# EAGLE design e-Tapperhandpiece18 (EAGLE 8.4.1)
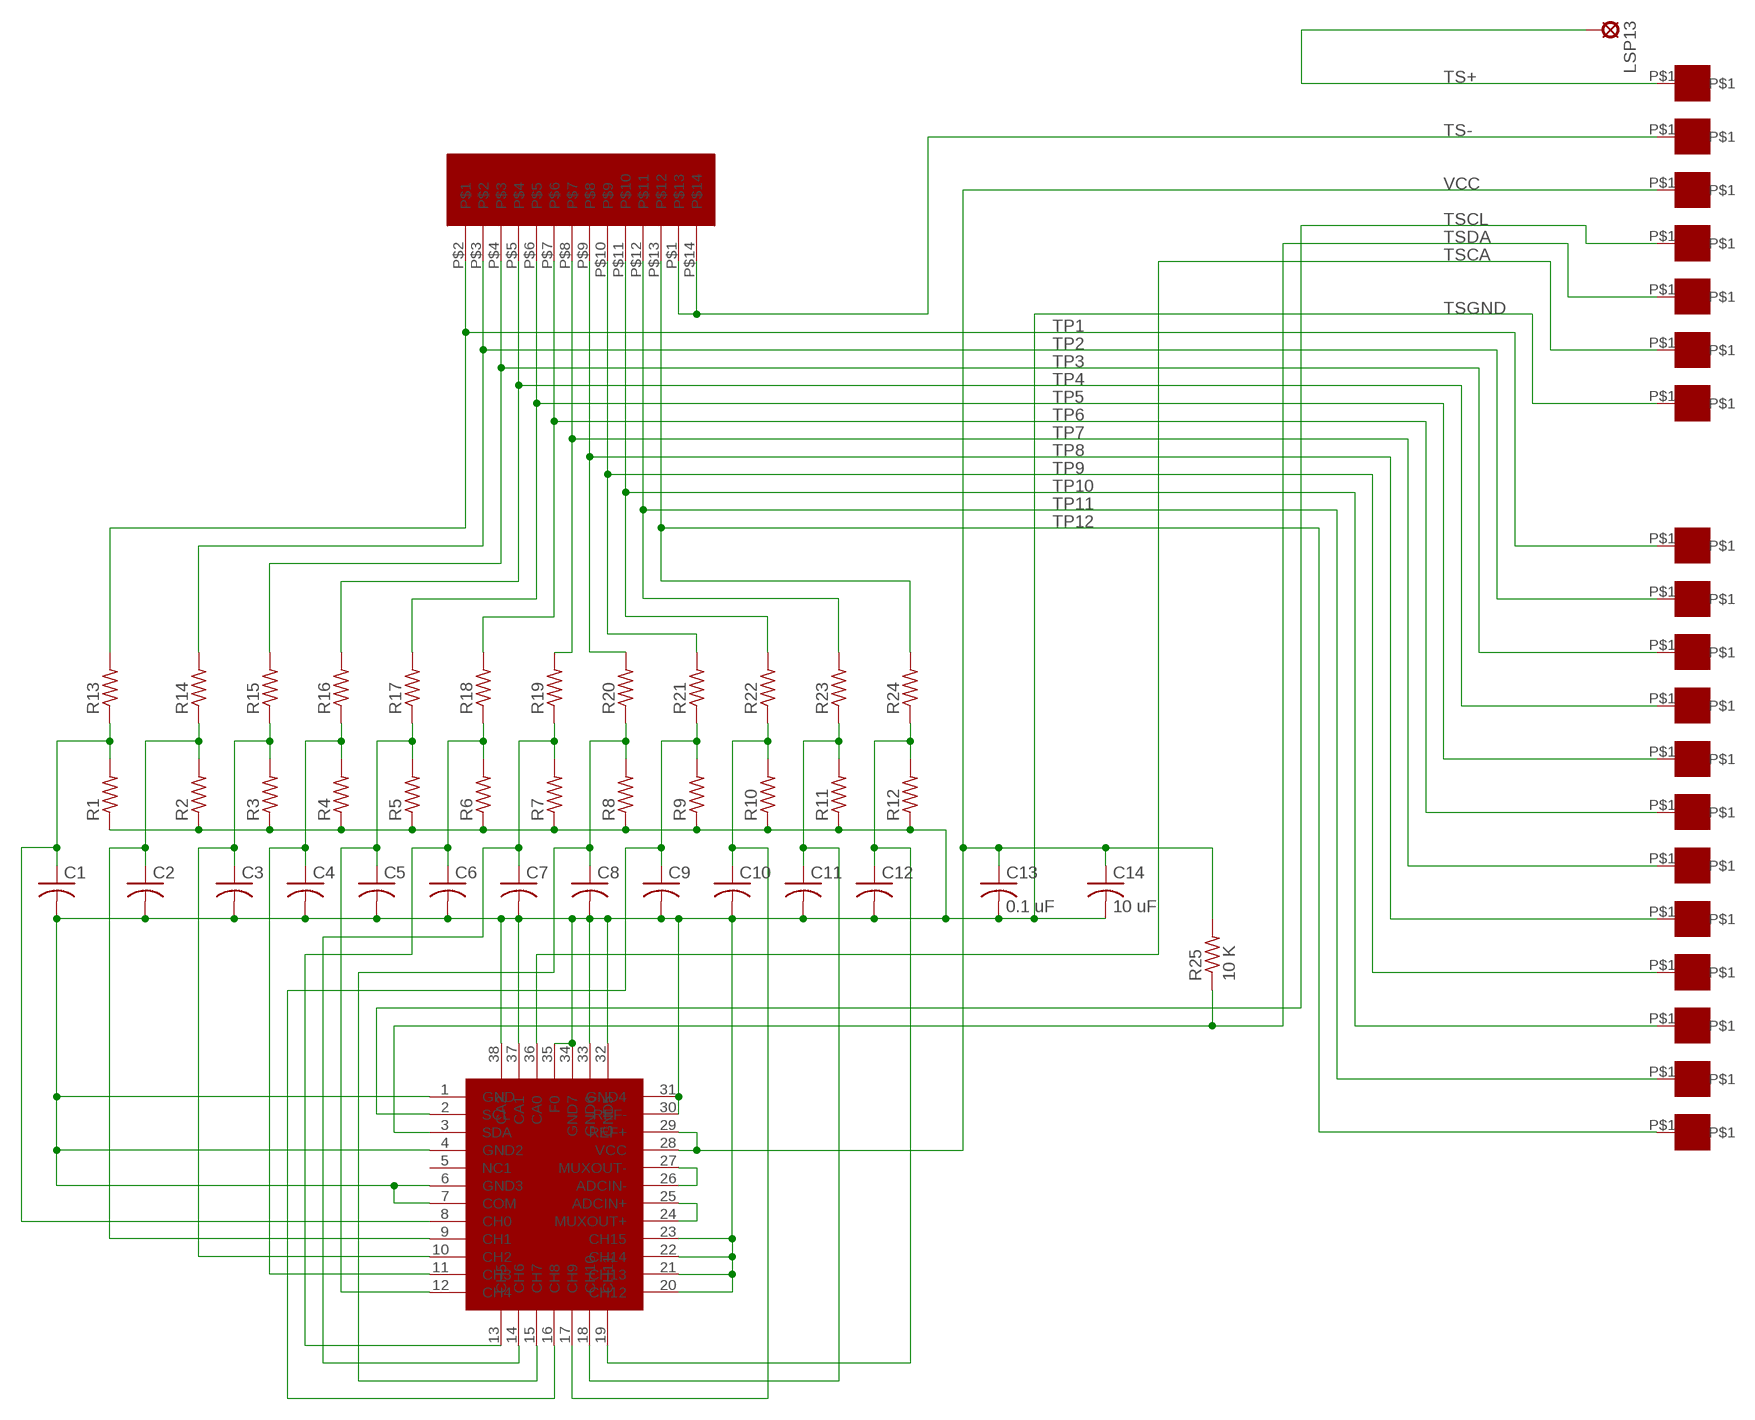
[diagram p0: schematic, sheet 1]

## Parts
C1  C-USC0603  [C0603]
C2  C-USC0603  [C0603]
C3  C-USC0603  [C0603]
C4  C-USC0603  [C0603]
C5  C-USC0603  [C0603]
C6  C-USC0603  [C0603]
C7  C-USC0603  [C0603]
C8  C-USC0603  [C0603]
C9  C-USC0603  [C0603]
C10  C-USC0603  [C0603]
C11  C-USC0603  [C0603]
C12  C-USC0603  [C0603]
C13  0.1 uF  C-USC0603  [C0603]
C14  10 uF  C-USC0805  [C0805]
LSP13  SE11  [SE11]
R1  R-US_R0402  [R0402]
R2  R-US_R0402  [R0402]
R3  R-US_R0402  [R0402]
R4  R-US_R0402  [R0402]
R5  R-US_R0402  [R0402]
R6  R-US_R0402  [R0402]
R7  R-US_R0402  [R0402]
R8  R-US_R0402  [R0402]
R9  R-US_R0402  [R0402]
R10  R-US_R0402  [R0402]
R11  R-US_R0402  [R0402]
R12  R-US_R0402  [R0402]
R13  R-US_R0402  [R0402]
R14  R-US_R0402  [R0402]
R15  R-US_R0402  [R0402]
R16  R-US_R0402  [R0402]
R17  R-US_R0402  [R0402]
R18  R-US_R0402  [R0402]
R19  R-US_R0402  [R0402]
R20  R-US_R0402  [R0402]
R21  R-US_R0402  [R0402]
R22  R-US_R0402  [R0402]
R23  R-US_R0402  [R0402]
R24  R-US_R0402  [R0402]
R25  10 K  R-US_R0402  [R0402]
TSP1  ET1  [ET1]
TSP2  ET1  [ET1]
TSP3  ET1  [ET1]
TSP4  ET1  [ET1]
TSP5  ET1  [ET1]
TSP6  ET1  [ET1]
TSP7  ET1  [ET1]
TSP8  ET1  [ET1]
TSP9  ET1  [ET1]
TSP10  ET1  [ET1]
TSP11  ET1  [ET1]
TSP12  ET1  [ET1]
TSP13  ET1  [ET1]
TSP14  ET1  [ET1]
TSP15  ET1  [ET1]
TSP16  ET1  [ET1]
TSP17  ET1  [ET1]
TSP18  ET1  [ET1]
TSP19  ET1  [ET1]
U$1  LTC2497  [QFN38-5X7]
U$2  SS112D01  [SS112D01]

## Nets
N$1: C9.1 R9.2 R21.1 U$1.16(CH8)
N$2: U$1.26(ADCIN-) U$1.27(MUXOUT-)
N$3: U$1.24(MUXOUT+) U$1.25(ADCIN+)
N$5: C12.1 R12.2 R24.1 U$1.19(CH11)
N$7: C4.1 R4.2 R16.1 U$1.11(CH3)
N$8: C10.1 R10.2 R22.1 U$1.17(CH9)
N$9: C8.1 R8.2 R20.1 U$1.15(CH7)
N$18: C5.1 R5.2 R17.1 U$1.12(CH4)
N$19: C6.1 R6.2 R18.1 U$1.13(CH5)
N$20: C7.1 R7.2 R19.1 U$1.14(CH6)
N$22: C3.1 R3.2 R15.1 U$1.10(CH2)
N$23: C2.1 R2.2 R14.1 U$1.9(CH1)
N$24: C11.1 R11.2 R23.1 U$1.18(CH10)
N$25: C1.1 R1.2 R13.1 U$1.8(CH0)
TP1: R13.2 TSP1.P$1 U$2.P$2
TP2: R14.2 TSP2.P$1 U$2.P$3
TP3: R15.2 TSP3.P$1 U$2.P$4
TP4: R16.2 TSP4.P$1 U$2.P$5
TP5: R17.2 TSP5.P$1 U$2.P$6
TP6: R18.2 TSP6.P$1 U$2.P$7
TP7: R19.2 TSP7.P$1 U$2.P$8
TP8: R20.2 TSP8.P$1 U$2.P$9
TP9: R21.2 TSP9.P$1 U$2.P$10
TP10: R22.2 TSP10.P$1 U$2.P$11
TP11: R23.2 TSP11.P$1 U$2.P$12
TP12: R24.2 TSP12.P$1 U$2.P$13
TS+: LSP13.MP TSP13.P$1
TS-: TSP14.P$1 U$2.P$1 U$2.P$14
TSCA: TSP18.P$1 U$1.36(CA0)
TSCL: TSP16.P$1 U$1.2(SCL)
TSDA: R25.1 TSP17.P$1 U$1.3(SDA)
TSGND: C1.2 C2.2 C3.2 C4.2 C5.2 C6.2 C7.2 C8.2 C9.2 C10.2 C11.2 C12.2 C13.2 C14.2 R1.1 R2.1 R3.1 R4.1 R5.1 R6.1 R7.1 R8.1 R9.1 R10.1 R11.1 R12.1 TSP19.P$1 U$1.1(GND) U$1.4(GND2) U$1.6(GND3) U$1.7(COM) U$1.20(CH12) U$1.21(CH13) U$1.22(CH14) U$1.23(CH15) U$1.30(REF-) U$1.31(GND4) U$1.32(GND5) U$1.33(GND6) U$1.34(GND7) U$1.35(F0) U$1.37(CA1) U$1.38(CA2)
VCC: C13.1 C14.1 R25.2 TSP15.P$1 U$1.28(VCC) U$1.29(REF+)
Unconnected: U$1.5(NC1)

## Library data of the parts
C1-C14 = rcl:C-US: CAPACITOR, American symbol
LSP13 = solpad:SE11: SOLDER PAD RTM, drill 1,1mm, distributor Buerklin, 07F810
R1-R25 = resistor:R-US_: RESISTOR, American symbol
TSP1-TSP19 = ET1:ET1: Through Hold Pads 20 mil drill hole
U$1 = LTC2497:LTC2497: LTC2497 16 Channel ADC with I2C interface
U$2 = SS112D01:SS112D01

## Net classes
0 default: clearance 0.205 mm

## Board
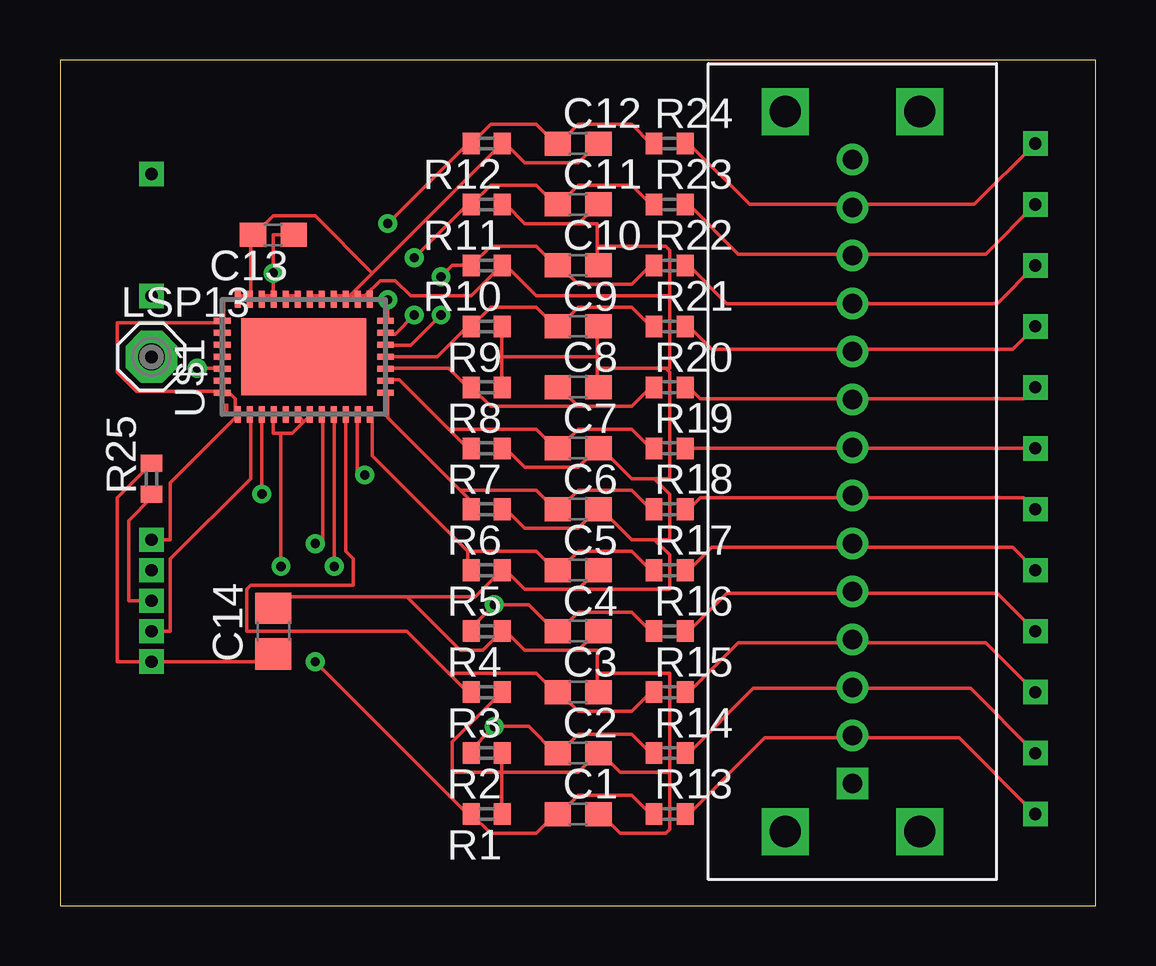
[diagram p1: board, top side]
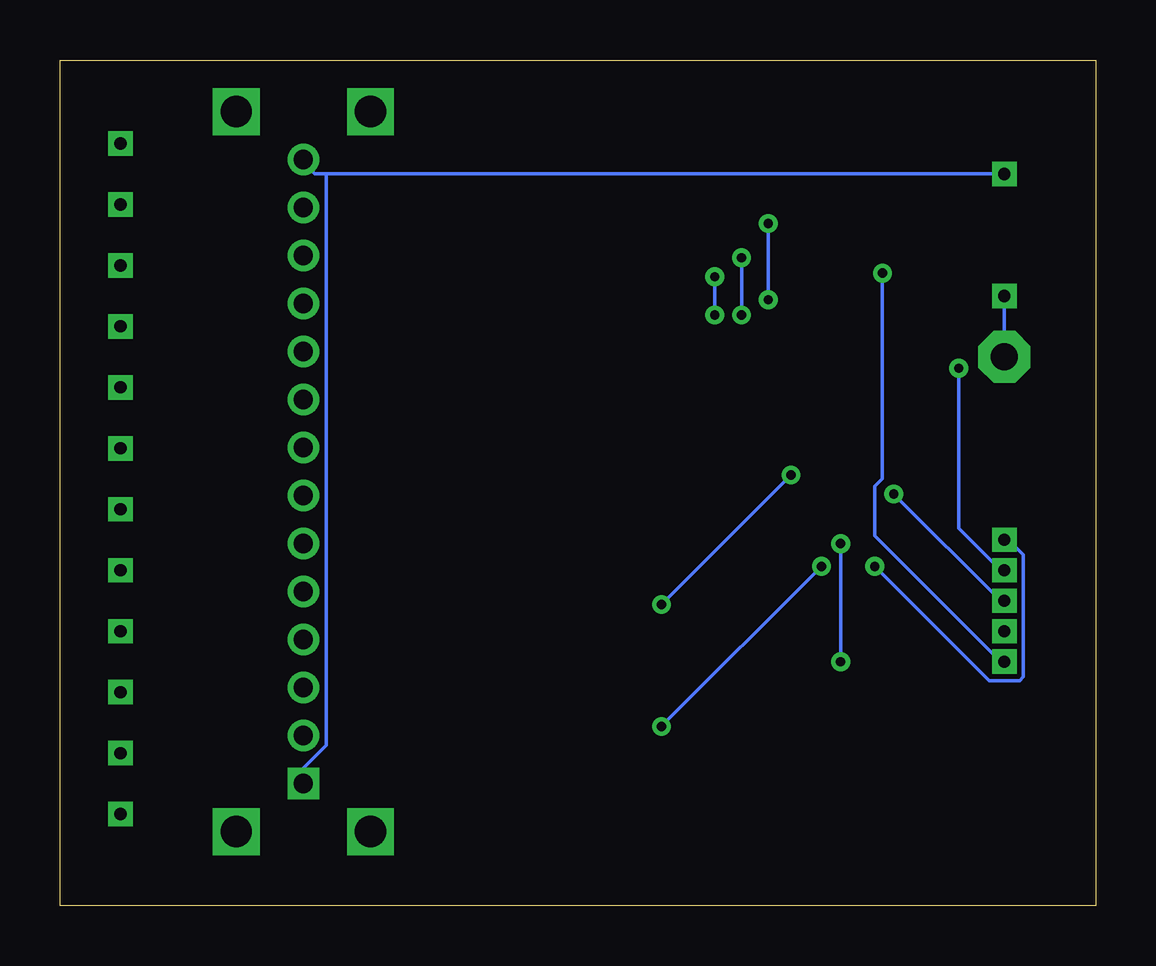
[diagram p2: board, bottom side, seen from below]

Size 43.16 x 35.23 mm. Coordinates in mm from the lower left corner, seen from the top.
Outline: 0,0 43.16,0 43.16,35.23 0,35.23 0,0
Copper layers (1*16): Top 0.035mm / dielectric 1.5mm / Bottom 0.035mm
Design rules "e-tapperhandpiece14 *": minimum track width 6mil, minimum drill 15mil, track to track 6mil, track to pad 6mil, pad to pad 6mil, via to via 6mil, smd to smd 5mil, copper to edge 6mil, drill to drill 6mil, minimum pad ring 10mil, minimum via ring 8mil, stop-mask expansion 4mil, vias tented up to drill 0mil, thermal gap 10mil

### Footprints (pad centres in the part's own frame; a part is rotated, then mirrored left to right if it is on the bottom)
C0603 = smd 1.1 x 1: 1 -0.85,0; 2 0.85,0
C0805 = smd 1.3 x 1.5: 1 -0.95,0; 2 0.95,0
SE11 = drill 1.118 pad 2.159 octagon: MP 0,0
R0402 = smd 0.7 x 0.9: 1 -0.65,0; 2 0.65,0
ET1 = drill 0.508 square: P$1 0,0
QFN38-5X7 = smd 0.7 x 0.25: 1 -2.4,2.75; 2 -2.4,2.25; 3 -2.4,1.75; 4 -2.4,1.25; 5 -2.4,0.75; 6 -2.4,0.25; 7 -2.4,-0.25; 8 -2.4,-0.75; 9 -2.4,-1.25; 10 -2.4,-1.75; 11 -2.4,-2.25; 12 -2.4,-2.75; 20 2.4,-2.75; 21 2.4,-2.25; 22 2.4,-1.75; 23 2.4,-1.25; 24 2.4,-0.75; 25 2.4,-0.25; 26 2.4,0.25; 27 2.4,0.75; 28 2.4,1.25; 29 2.4,1.75; 30 2.4,2.25; 31 2.4,2.75 | smd 0.25 x 0.7: 13 -1.5,-3.4; 14 -1,-3.4; 15 -0.5,-3.4; 16 0,-3.4; 17 0.5,-3.4; 18 1,-3.4; 19 1.5,-3.4; 32 1.5,3.4; 33 1,3.4; 34 0.5,3.4; 35 0,3.4; 36 -0.5,3.4; 37 -1,3.4; 38 -1.5,3.4 | smd 3.2 x 5.2: EXP 0,0
SS112D01 = drill 0.8 square: P$1 6.35,3.81 | drill 0.8: P$2 6.35,5.81; P$3 6.35,7.81; P$4 6.35,9.81; P$5 6.35,11.81; P$6 6.35,13.81; P$7 6.35,15.81; P$8 6.35,17.81; P$9 6.35,19.81; P$10 6.35,21.81; P$11 6.35,23.81; P$12 6.35,25.81; P$13 6.35,27.81; P$14 6.35,29.81 | drill 1.3 square: P$15 9.15,31.81; P$16 3.55,31.81; P$17 9.15,1.81; P$18 3.55,1.81

### Placement (x,y rotation side)
C1  21.59,3.81 0 top
C2  21.59,6.35 0 top
C3  21.59,8.89 0 top
C4  21.59,11.43 0 top
C5  21.59,13.97 0 top
C6  21.59,16.51 0 top
C7  21.59,19.05 0 top
C8  21.59,21.59 0 top
C9  21.59,24.13 0 top
C10  21.59,26.67 0 top
C11  21.59,29.21 0 top
C12  21.59,31.75 0 top
C13  8.89,27.94 180 top
C14  8.89,11.43 90 top
LSP13  3.81,22.86 0 top
R1  17.78,3.81 180 top
R2  17.78,6.35 180 top
R3  17.78,8.89 180 top
R4  17.78,11.43 180 top
R5  17.78,13.97 180 top
R6  17.78,16.51 180 top
R7  17.78,19.05 180 top
R8  17.78,21.59 180 top
R9  17.78,24.13 180 top
R10  17.78,26.67 180 top
R11  17.78,29.21 180 top
R12  17.78,31.75 180 top
R13  25.4,3.81 0 top
R14  25.4,6.35 0 top
R15  25.4,8.89 0 top
R16  25.4,11.43 0 top
R17  25.4,13.97 0 top
R18  25.4,16.51 0 top
R19  25.4,19.05 0 top
R20  25.4,21.59 0 top
R21  25.4,24.13 0 top
R22  25.4,26.67 0 top
R23  25.4,29.21 0 top
R24  25.4,31.75 0 top
R25  3.81,17.78 90 top
TSP1  40.64,3.81 0 top
TSP2  40.64,6.35 0 top
TSP3  40.64,8.89 0 top
TSP4  40.64,11.43 0 top
TSP5  40.64,13.97 0 top
TSP6  40.64,16.51 0 top
TSP7  40.64,19.05 0 top
TSP8  40.64,21.59 0 top
TSP9  40.64,24.13 0 top
TSP10  40.64,26.67 0 top
TSP11  40.64,29.21 0 top
TSP12  40.64,31.75 0 top
TSP13  3.81,25.4 0 top
TSP14  3.81,30.48 0 top
TSP15  3.81,10.16 0 top
TSP16  3.81,11.43 0 top
TSP17  3.81,12.7 0 top
TSP18  3.81,13.97 90 top
TSP19  3.81,15.24 90 top
U$1  10.16,22.86 90 top
U$2  26.67,1.27 0 top

### Tracks (layer width: path | path; a pad name or v marks a point on that pad's centre or on a via)
N$1
  Top 0.152: R21.1 24.61,24.13 23.81,24.92 21.59,24.92 20.8,24.13 C9.1 20.64,24.13 19.84,24.92 17.94,24.92 17.14,24.13 R9.2 16.99,24.13 15.72,22.86 U$1.16
N$2
  Top 0.152: U$1.27 9.53,25.4 9.84,25.4 U$1.26
N$3
  Top 0.152: U$1.25 10.48,25.4 10.79,25.4 U$1.24
N$5  (via drill 0.38)
  Top 0.152: R24.1 24.61,31.75 23.81,32.54 21.59,32.54 20.8,31.75 C12.1 20.64,31.75 19.84,32.54 17.94,32.54 17.14,31.75 R12.2 16.99,31.75 v13.65,28.42 | v13.65,25.24 13.65,24.45 U$1.19
  Bottom 0.152: v13.65,28.42 v13.65,25.24
N$7  (via drill 0.38)
  Top 0.152: R16.1 24.61,11.43 23.81,12.22 21.59,12.22 20.8,11.43 C4.1 20.64,11.43 19.53,12.54 v18.1,12.54 16.99,11.43 R4.2 | v12.7,17.94 12.38,17.94 12.38,20.32 U$1.11
  Bottom 0.152: v18.1,12.54 v12.7,17.94
N$8  (via drill 0.38)
  Top 0.152: R22.1 24.61,26.67 23.81,25.88 21.59,25.88 20.8,26.67 C10.1 20.64,26.67 19.84,27.46 17.94,27.46 17.14,26.67 R10.2 16.35,26.67 v15.88,26.19 | v15.88,24.61 14.61,23.34 13.65,23.34 U$1.17
  Bottom 0.152: v15.88,26.19 v15.88,24.61
N$9
  Top 0.152: U$1.15 13.65,22.38 16.19,22.38 16.99,21.59 R8.2 17.14,21.59 17.94,20.8 21.59,20.8 | 21.59,20.8 23.81,20.8 24.61,21.59 R20.1 | 21.59,20.8 20.8,21.59 C8.1
N$18
  Top 0.152: R17.1 24.61,13.97 23.81,14.76 21.59,14.76 20.8,13.97 C5.1 20.64,13.97 19.84,14.76 16.99,14.76 | 16.99,14.76 13.02,18.73 13.02,20.32 U$1.12 | 16.99,14.76 16.99,13.97 R5.2
N$19
  Top 0.152: R18.1 24.61,16.51 23.81,17.3 21.59,17.3 20.8,16.51 C6.1 20.64,16.51 19.84,17.3 16.67,17.3 | 16.67,17.3 16.99,16.99 16.99,16.51 R6.2 | 16.67,17.3 13.65,20.32 13.65,21.27 U$1.13
N$20
  Top 0.152: R19.1 24.61,19.05 23.81,19.84 21.59,19.84 20.8,19.05 C7.1 20.64,19.05 19.84,19.84 16.19,19.84 | 16.19,19.84 16.99,19.05 R7.2 | 16.19,19.84 14.13,21.91 13.65,21.91 U$1.14
N$22
  Top 0.152: R15.1 24.61,8.89 23.81,8.1 21.59,8.1 20.8,8.89 C3.1 20.64,8.89 19.84,9.68 16.19,9.68 | 16.19,9.68 16.99,8.89 R3.2 | 16.19,9.68 14.45,11.43 7.78,11.43 7.78,13.18 7.94,13.34 12.22,13.34 12.22,14.45 11.91,14.76 11.91,20.32 U$1.10
N$23  (via drill 0.38)
  Top 0.152: R14.1 24.61,6.35 23.81,7.14 21.59,7.14 20.8,6.35 C2.1 20.64,6.35 19.53,7.46 v18.1,7.46 16.99,6.35 R2.2 | v11.43,14.13 11.43,20.32 U$1.9
  Bottom 0.152: v18.1,7.46 v11.43,14.13
N$24  (via drill 0.38)
  Top 0.152: R23.1 24.61,29.21 23.81,30 21.59,30 20.8,29.21 C11.1 20.64,29.21 19.84,30 17.94,30 17.14,29.21 R11.2 16.99,29.21 v14.76,26.99 | v14.76,24.61 13.97,23.81 13.65,23.81 U$1.18
  Bottom 0.152: v14.76,26.99 v14.76,24.61
N$25  (via drill 0.38)
  Top 0.152: R13.1 24.61,3.81 23.81,4.6 21.59,4.6 20.8,3.81 C1.1 20.64,3.81 19.84,3.02 17.94,3.02 17.14,3.81 R1.2 16.99,3.81 v10.64,10.16 | v10.64,15.08 10.95,15.08 10.95,20.32 U$1.8
  Bottom 0.152: v10.64,10.16 v10.64,15.08
TP1
  Top 0.152: 33.02,6.99 29.37,6.99 26.19,3.81 R13.2 | TSP1.P$1 37.47,6.99 33.02,6.99 | 33.02,6.99 U$2.P$2
TP2
  Top 0.152: 33.02,9.05 28.89,9.05 26.19,6.35 R14.2 | TSP2.P$1 37.94,9.05 33.02,9.05 | 33.02,9.05 U$2.P$3
TP3
  Top 0.152: 33.02,10.95 28.26,10.95 26.19,8.89 R15.2 | TSP3.P$1 38.58,10.95 33.02,10.95 | 33.02,10.95 U$2.P$4
TP4
  Top 0.152: 33.02,13.02 27.78,13.02 26.19,11.43 R16.2 | TSP4.P$1 39.05,13.02 33.02,13.02 | 33.02,13.02 U$2.P$5
TP5
  Top 0.152: 33.02,14.92 27.15,14.92 26.19,13.97 R17.2 | TSP5.P$1 39.69,14.92 33.02,14.92 | 33.02,14.92 U$2.P$6
TP6
  Top 0.152: 33.02,16.99 26.67,16.99 26.19,16.51 R18.2 | TSP6.P$1 40.16,16.99 33.02,16.99 | 33.02,16.99 U$2.P$7
TP7
  Top 0.152: 33.02,19.05 R19.2 | 33.02,19.05 TSP7.P$1 | 33.02,19.05 U$2.P$8
TP8
  Top 0.152: 33.02,21.11 26.67,21.11 26.19,21.59 R20.2 | TSP8.P$1 40.16,21.11 33.02,21.11 | 33.02,21.11 U$2.P$9
TP9
  Top 0.152: 33.02,23.18 27.15,23.18 26.19,24.13 R21.2 | TSP9.P$1 39.69,23.18 33.02,23.18 | 33.02,23.18 U$2.P$10
TP10
  Top 0.152: U$2.P$11 27.78,25.08 26.19,26.67 R22.2 | TSP10.P$1 39.05,25.08 U$2.P$11 | U$2.P$11
TP11
  Top 0.152: 33.02,27.15 28.26,27.15 26.19,29.21 R23.2 | TSP11.P$1 38.58,27.15 33.02,27.15 | 33.02,27.15 U$2.P$12
TP12
  Top 0.152: 33.02,29.21 28.73,29.21 26.19,31.75 R24.2 | TSP12.P$1 38.1,29.21 33.02,29.21 | 33.02,29.21 U$2.P$13
TS+
  Bottom 0.152: LSP13.MP TSP13.P$1
TS-
  Bottom 0.152: 32.07,30.48 32.54,30.48 33.02,30.96 U$2.P$14 | 32.07,30.48 TSP14.P$1 | U$2.P$1 33.02,5.71 32.07,6.67 32.07,30.48
TSCA  (via drill 0.38)
  Top 0.152: v5.71,22.38 6.67,22.38 U$1.36
  Bottom 0.152: v5.71,22.38 5.71,15.72 3.97,13.97 TSP18.P$1
TSCL
  Top 0.152: TSP16.P$1 4.6,11.43 4.6,14.45 7.94,17.78 7.94,20.32 U$1.2
TSDA  (via drill 0.38)
  Top 0.152: v8.41,17.14 8.41,20.32 U$1.3 | TSP17.P$1 2.86,12.7 2.86,16.03 3.81,16.99 R25.1
  Bottom 0.152: v8.41,17.14 3.97,12.7 TSP17.P$1
TSGND  (via drill 0.38)
  Top 0.152: U$1.38 6.83,21.43 6.83,21.75 U$1.37 | U$1.38 6.83,21.27 7.14,21.27 7.3,21.11 7.3,20.48 U$1.1 7.3,20.32 4.6,17.62 4.6,15.24 TSP19.P$1 | 9.21,19.68 9.68,19.68 10.16,20.16 | 9.21,19.68 8.89,19.68 8.89,20.32 U$1.4 | 10.16,20.16 10.32,20.32 U$1.7 | 10.16,20.16 10,20.32 U$1.6 | v9.21,14.13 9.21,19.68 | 6.83,23.34 6.83,22.86 U$1.35 | U$1.32 6.83,24.29 6.83,23.97 U$1.33 6.83,23.81 6.83,23.34 | 6.83,23.34 U$1.34 | 7.94,25.4 7.46,25.4 U$1.31 7.3,25.24 6.83,25.24 6.83,24.45 U$1.32 | 7.94,25.4 7.94,27.94 C13.2 8.1,27.94 8.89,28.73 10.64,28.73 13.02,26.35 | 7.94,25.4 U$1.30 | C12.2 22.38,31.75 21.59,30.96 19.37,30.96 18.57,31.75 R12.1 18.41,31.75 13.02,26.35 | 11.91,25.4 11.43,25.4 U$1.23 | 11.91,25.4 12.06,25.4 | 12.06,25.4 12.38,25.4 | 11.91,25.4 U$1.22 | 12.38,25.4 12.7,25.4 | 12.7,25.4 12.86,25.4 U$1.20 | 12.38,25.4 U$1.21 | 12.7,25.4 13.34,26.04 13.97,26.04 14.61,25.4 17.14,25.4 18.41,26.67 R10.1 18.57,26.67 19.84,25.4 25.4,25.4 | 12.06,25.4 13.02,26.35 | U$1.38 6.67,21.43 3.17,21.43 2.38,22.23 2.38,24.29 6.67,24.29 U$1.32 | 25.4,5.56 25.4,3.17 25.24,3.02 23.34,3.02 22.54,3.81 C1.2 | 25.4,5.56 23.34,5.56 22.54,6.35 C2.2 22.38,6.35 21.59,5.56 18.41,5.56 | 18.41,5.56 18.41,6.35 R2.1 | 18.41,5.56 18.41,3.81 R1.1 | 18.41,5.56 16.35,5.56 16.35,6.83 18.41,8.89 R3.1 | 21.59,28.42 19.37,28.42 18.57,29.21 R11.1 | 21.59,28.42 22.38,29.21 C11.2 | 22.38,27.46 22.38,28.42 21.59,28.42 | 22.38,27.46 22.38,26.67 C10.2 | 18.41,22.86 18.41,24.13 R9.1 | 18.41,22.86 18.41,21.59 R8.1 | 22.38,22.86 22.38,24.13 C9.2 | 22.38,22.86 22.38,22.38 | 22.38,22.38 22.38,21.59 C8.2 | 22.38,22.86 18.41,22.86 | 21.59,10.64 19.37,10.64 18.57,11.43 R4.1 18.41,11.43 17.62,10.64 16.67,10.64 14.45,12.86
  Top 0.152: 21.59,10.64 22.38,11.43 C4.2 | 22.38,9.68 22.38,10.64 21.59,10.64 | 22.38,9.68 22.38,8.89 C3.2 | R7.1 18.57,19.05 19.37,18.26 21.59,18.26 22.38,19.05 C7.2 22.54,19.05 23.81,17.78 24.77,17.78 | R6.1 18.57,16.51 19.37,15.72 21.59,15.72 22.38,16.51 C6.2 22.54,16.51 23.81,15.24 24.77,15.24 | 21.59,13.18 19.37,13.18 18.57,13.97 R5.1 18.41,13.97 17.3,12.86 14.45,12.86 | 21.59,13.18 22.38,13.97 C5.2 | 14.45,12.86 9.37,12.86 C14.2 | 24.77,15.24 25.4,14.61 25.4,13.18 21.59,13.18 | 24.77,17.78 25.4,17.14 25.4,15.24 24.77,15.24 | 25.24,22.38 22.38,22.38 | 25.24,22.38 25.4,22.23 25.4,17.78 24.77,17.78 | 22.38,27.46 25.24,27.46 25.4,27.3 25.4,25.4 | 25.4,25.4 25.4,22.38 25.24,22.38 | 25.4,5.56 25.4,9.68 22.38,9.68
  Bottom 0.152: v9.21,14.13 4.45,9.37 3.17,9.37 3.02,9.53 3.02,14.61 3.65,15.24 TSP19.P$1
VCC  (via drill 0.38)
  Top 0.152: 8.89,25.4 8.41,25.4 U$1.29 | 8.89,25.4 v8.89,26.35 8.89,27.94 C13.1 | 8.89,25.4 U$1.28 | R25.2 3.81,18.41 2.38,16.99 2.38,10.16 TSP15.P$1 8.57,10.16 C14.1
  Bottom 0.152: v8.89,26.35 8.89,17.78 9.21,17.46 9.21,15.4 3.97,10.16 TSP15.P$1